# EAGLE schematic E2_TrainingBoard (EAGLE 9.0.1)
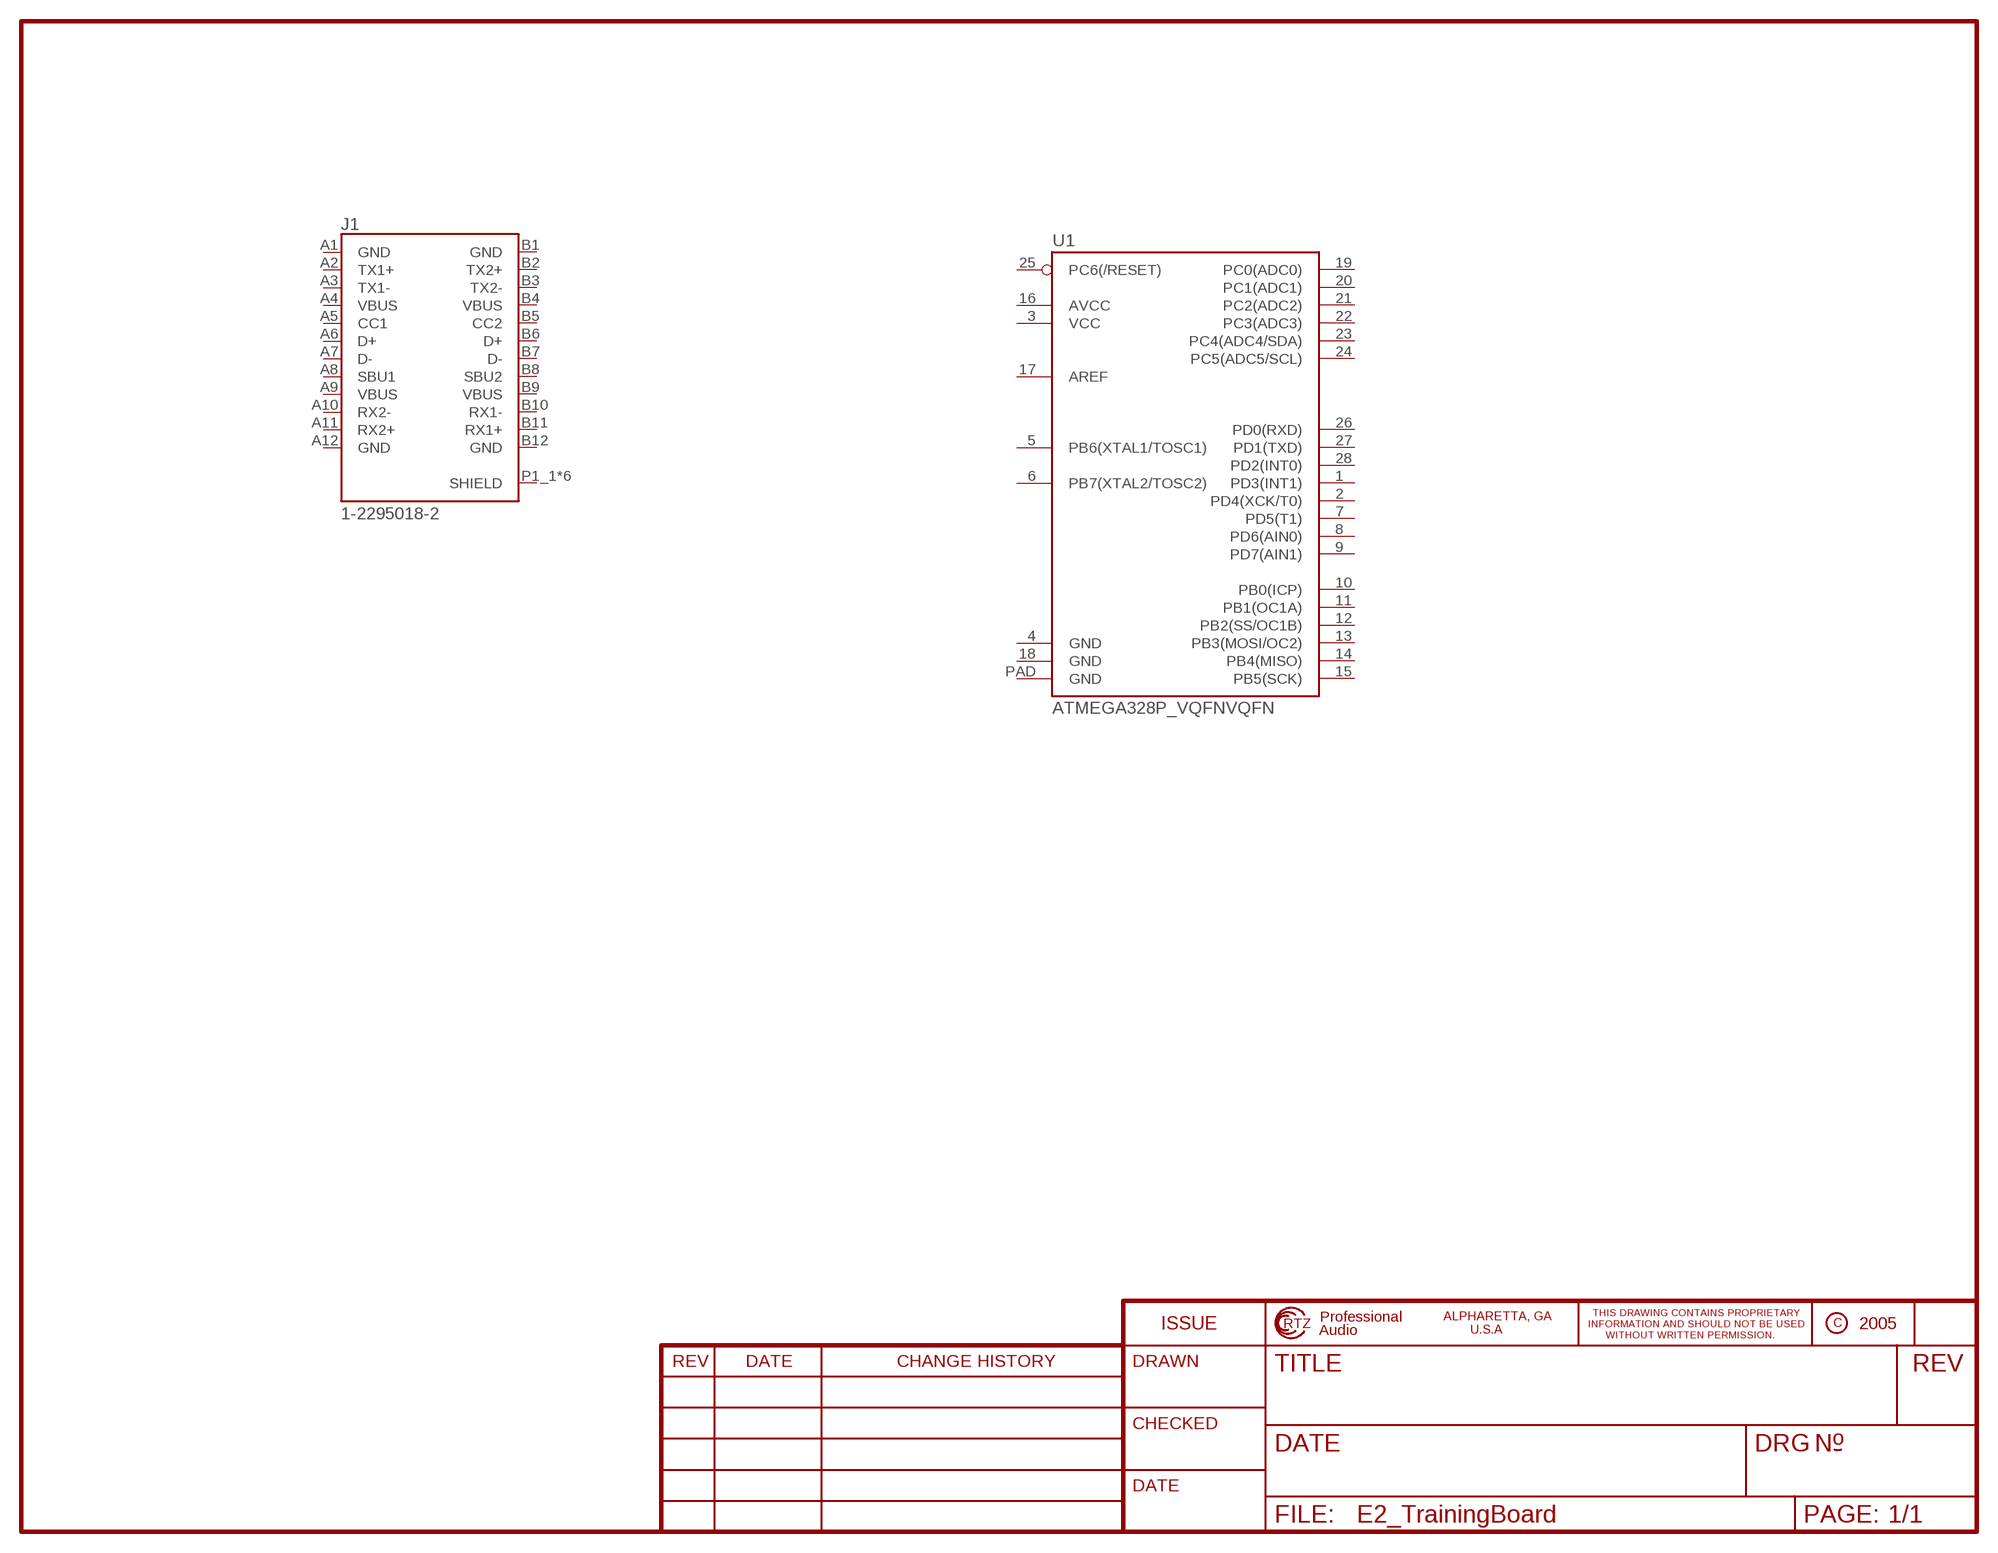
[diagram p0: schematic, sheet 1]

## Parts
J1  1-2295018-2  [TE_1-2295018-2]
U1  ATMEGA328P_VQFNVQFN  [VQFN-28]
Unconnected: J1.A1(GND) J1.A2(TX1+) J1.A3(TX1-) J1.A4(VBUS) J1.A5(CC1) J1.A6(D+) J1.A7(D-) J1.A8(SBU1) J1.A9(VBUS) J1.A10(RX2-) J1.A11(RX2+) J1.A12(GND) J1.B1(GND) J1.B2(TX2+) J1.B3(TX2-) J1.B4(VBUS) J1.B5(CC2) J1.B6(D+) J1.B7(D-) J1.B8(SBU2) J1.B9(VBUS) J1.B10(RX1-) J1.B11(RX1+) J1.B12(GND) J1.P1_1(SHIELD) J1.P1_2(SHIELD) J1.P2_1(SHIELD) J1.P2_2(SHIELD) J1.P4(SHIELD) J1.P5(SHIELD) U1.1(PD3(INT1)) U1.2(PD4(XCK/T0)) U1.3(VCC) U1.4(GND) U1.5(PB6(XTAL1/TOSC1)) U1.6(PB7(XTAL2/TOSC2)) U1.7(PD5(T1)) U1.8(PD6(AIN0)) U1.9(PD7(AIN1)) U1.10(PB0(ICP)) U1.11(PB1(OC1A)) U1.12(PB2(SS/OC1B)) U1.13(PB3(MOSI/OC2)) U1.14(PB4(MISO)) U1.15(PB5(SCK)) U1.16(AVCC) U1.17(AREF) U1.18(GND) U1.19(PC0(ADC0)) U1.20(PC1(ADC1)) U1.21(PC2(ADC2)) U1.22(PC3(ADC3)) U1.23(PC4(ADC4/SDA)) U1.24(PC5(ADC5/SCL)) U1.25(PC6(/RESET)) U1.26(PD0(RXD)) U1.27(PD1(TXD)) U1.28(PD2(INT0)) U1.PAD(GND)

## Library data of the parts
J1 = USB-C:1-2295018-2: SPLASH PROOF USB TYPE C REC, DUAL SMT; Tape/Reel of 900; AVAILABILITY: Unavailable; COMMENT: 1-2295018-2; DESCRIPTION: Conn USB Type C RCP 12 POS Solder RA SMD 12 Terminal 1 Port T/R; MF: TE Connectivity; MP: 1-2295018-2; PACKAGE: None; PRICE: None; TE_PURCHASE_URL: https://www.te.com/usa-en/product-1-2295018-2.html?te_bu=Cor&te_type=disp&te_campaign=seda_glo_cor-seda-global-disp-prtnr-fy19-seda-model-bom-cta_sma-317_1&elqCampaignId=32493
U1 = SparkFun-IC-Microcontroller:ATMEGA328P_VQFN: Atmel 328P QFN part not in catalog